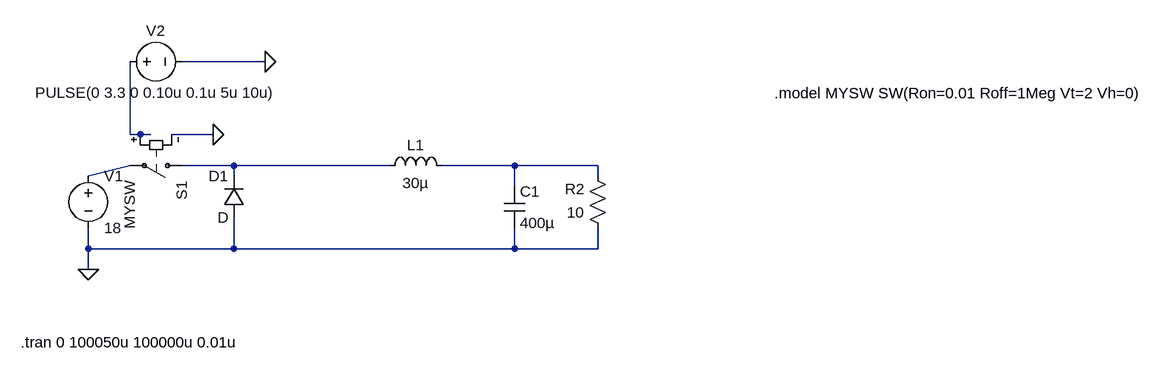
[diagram p0: schematic BUCK_TRANSIENT_SIMULATION.asc]
BUCK_TRANSIENT_SIMULATION.asc, the LTspice schematic file:
Version 4.1
SHEET 1 1452 680
WIRE -176 -16 -304 -16
WIRE -384 96 -384 -16
WIRE -368 96 -384 96
WIRE -352 96 -368 96
WIRE -256 96 -320 96
WIRE -224 144 -304 144
WIRE 16 144 -224 144
WIRE 208 144 96 144
WIRE 336 144 208 144
WIRE -448 160 -384 144
WIRE -224 160 -224 144
WIRE 336 160 336 144
WIRE 208 176 208 144
WIRE -448 272 -448 240
WIRE -224 272 -224 224
WIRE -224 272 -448 272
WIRE 208 272 208 240
WIRE 208 272 -224 272
WIRE 336 272 336 240
WIRE 336 272 208 272
WIRE -448 304 -448 272
FLAG -448 304 0
FLAG -176 -16 0
FLAG -256 96 0
SYMBOL res 352 256 R180
WINDOW 0 36 76 Left 2
WINDOW 3 36 40 Left 2
SYMATTR InstName R2
SYMATTR Value 10
SYMATTR SpiceLine pwr=100
SYMBOL voltage -448 144 R0
WINDOW 123 0 0 Left 0
WINDOW 39 0 0 Left 0
SYMATTR InstName V1
SYMATTR Value 18
SYMBOL ind 0 160 R270
WINDOW 0 32 56 VTop 2
WINDOW 3 5 56 VBottom 2
SYMATTR InstName L1
SYMATTR Value 30µ
SYMATTR SpiceLine Rser=0.01
SYMBOL cap 192 176 R0
SYMATTR InstName C1
SYMATTR Value 400µ
SYMATTR SpiceLine Rser=0.01
SYMBOL diode -208 224 R180
WINDOW 0 24 64 Left 2
WINDOW 3 24 0 Left 2
SYMATTR InstName D1
SYMBOL voltage -400 -16 R270
WINDOW 0 32 56 VTop 2
WINDOW 3 -32 56 VBottom 2
WINDOW 123 0 0 Left 0
WINDOW 39 0 0 Left 0
SYMATTR InstName V2
SYMATTR Value PULSE(0 3.3 0 0.10u 0.1u 5u 10u)
SYMBOL sw -288 144 R90
SYMATTR InstName S1
SYMATTR Value MYSW
TEXT -552 416 Left 2 !.tran 0 100050u 100000u 0.01u
TEXT 608 32 Left 2 !.model MYSW SW(Ron=0.01 Roff=1Meg Vt=2 Vh=0)

The netlist it stands for:
* BUCK_TRANSIENT_SIMULATION.asc
R2 0 N003 10 pwr=100
V1 N004 0 18
L1 N002 N003 30µ Rser=0.01
C1 N003 0 400µ Rser=0.01
D1 0 N002 D
V2 N001 0 PULSE(0 3.3 0 0.10u 0.1u 5u 10u)
S1 N002 N004 N001 0 MYSW
.model D D
.lib standard.dio
.tran 0 100050u 100000u 0.01u
.model MYSW SW(Ron=0.01 Roff=1Meg Vt=2 Vh=0)
.backanno
.end